# EAGLE schematic Model01_TOT (EAGLE 7.6.0)
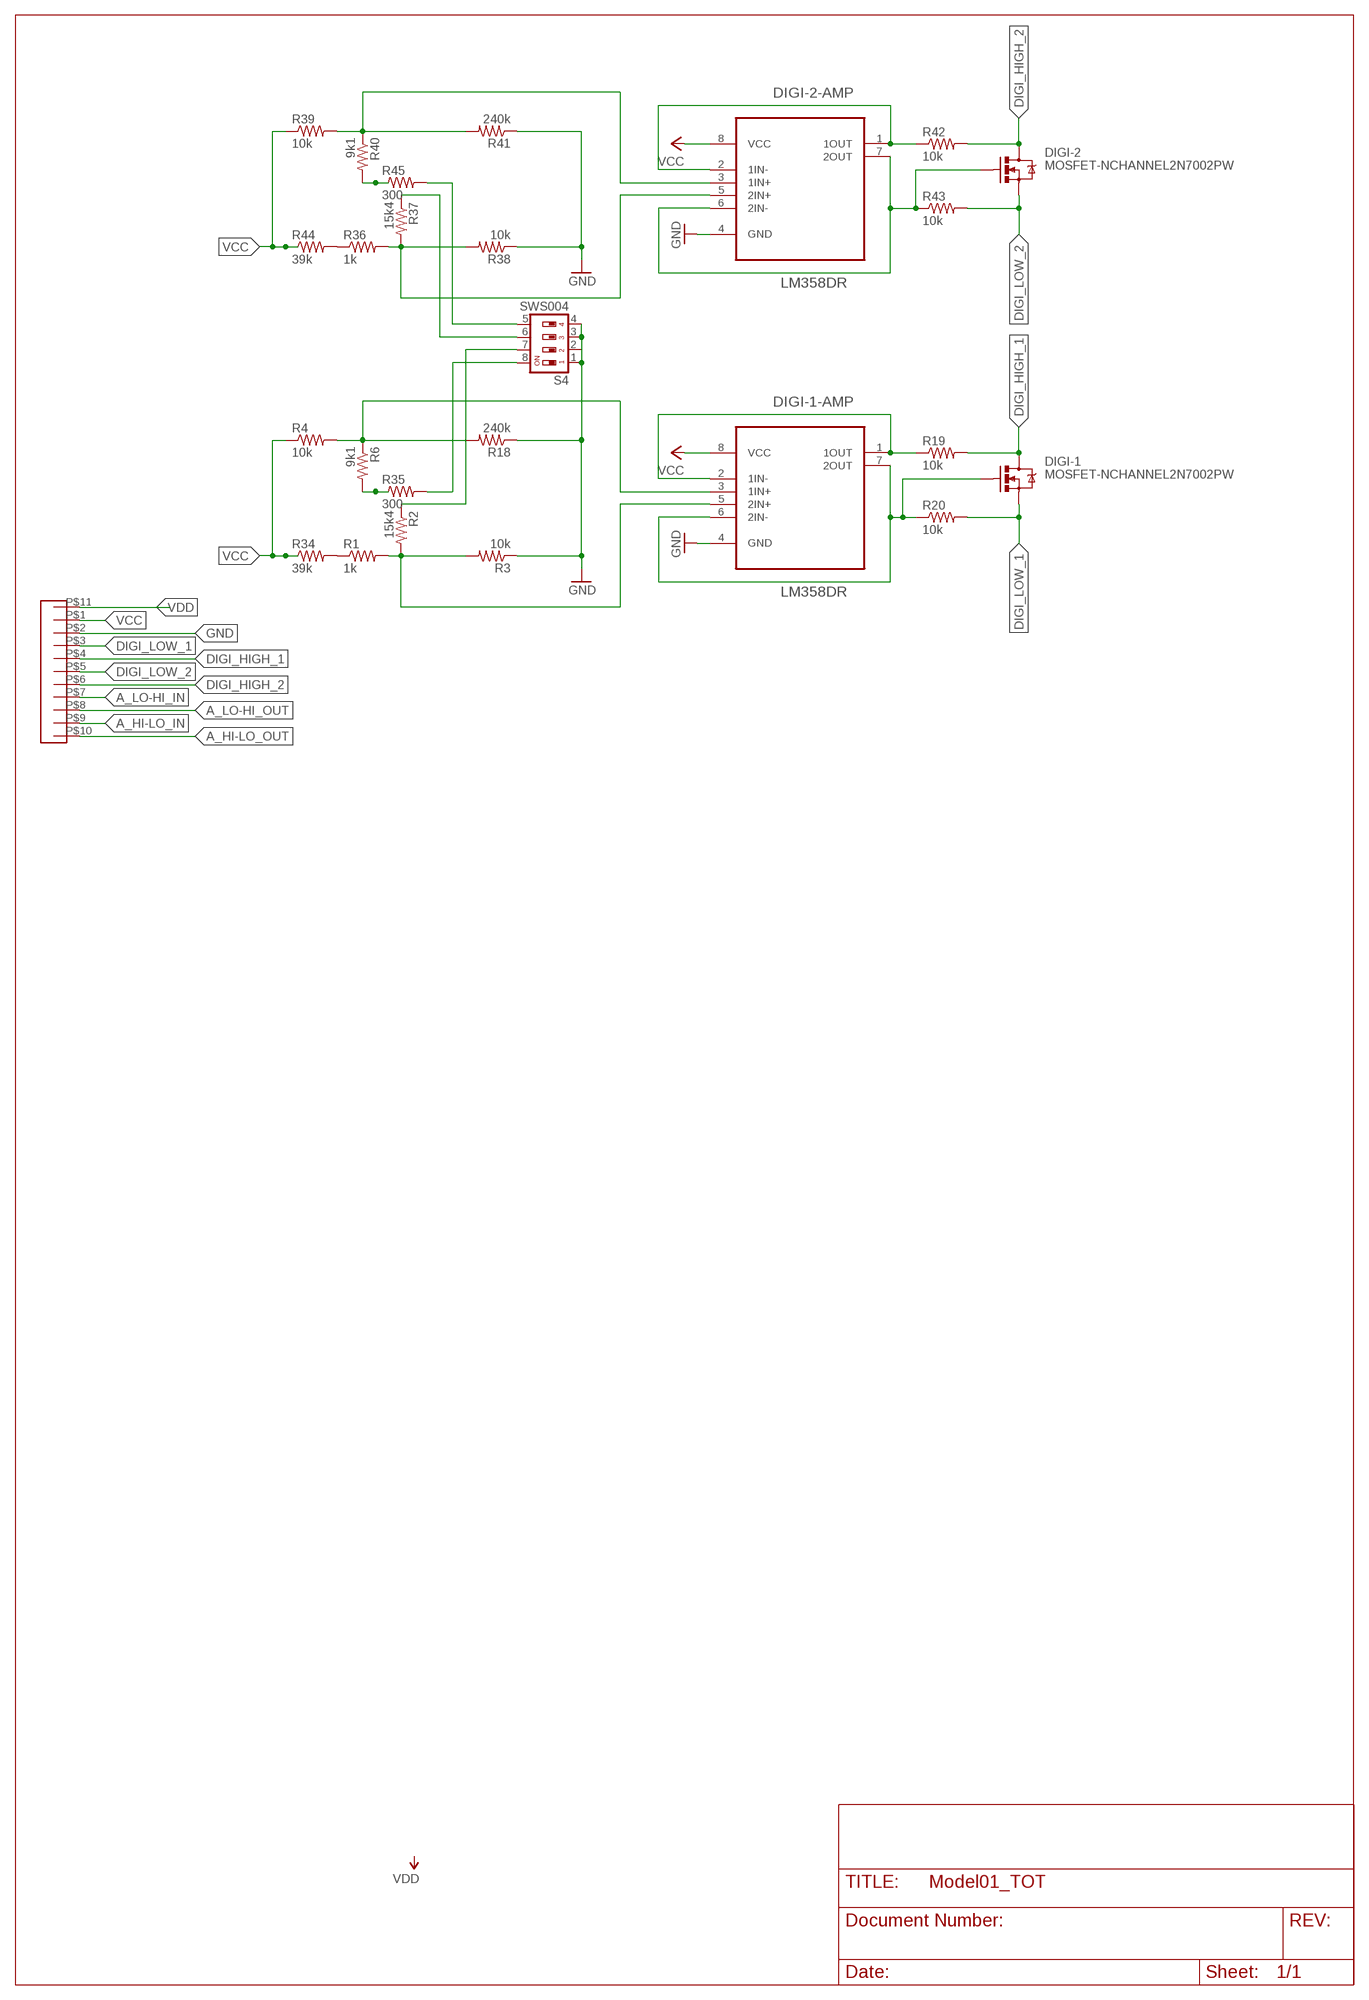
[diagram p0: schematic, sheet 1]

## Parts
DIGI-1  MOSFET-NCHANNEL2N7002PW  [SOT323]
DIGI-1-AMP  LM358DR  [SOIC127P600X175-8N]
DIGI-2  MOSFET-NCHANNEL2N7002PW  [SOT323]
DIGI-2-AMP  LM358DR  [SOIC127P600X175-8N]
R1  1k  R-US_R0805  [R0805]
R2  15k4  R-US_R0805  [R0805]
R3  10k  R-US_R0805  [R0805]
R4  10k  R-US_R0805  [R0805]
R6  9k1  R-US_R0805  [R0805]
R18  240k  R-US_R0805  [R0805]
R19  10k  R-US_R0805  [R0805]
R20  10k  R-US_R0805  [R0805]
R34  39k  R-US_R0805  [R0805]
R35  300  R-US_R0805  [R0805]
R36  1k  R-US_R0805  [R0805]
R37  15k4  R-US_R0805  [R0805]
R38  10k  R-US_R0805  [R0805]
R39  10k  R-US_R0805  [R0805]
R40  9k1  R-US_R0805  [R0805]
R41  240k  R-US_R0805  [R0805]
R42  10k  R-US_R0805  [R0805]
R43  10k  R-US_R0805  [R0805]
R44  39k  R-US_R0805  [R0805]
R45  300  R-US_R0805  [R0805]
S4  SWS004  [SMS-004]
U$1  5.08PITCHTERMINAL  [10KPL508]

## Nets
A_HI-LO_IN: U$1.P$9
A_HI-LO_OUT: U$1.P$10
A_LO-HI_IN: U$1.P$7
A_LO-HI_OUT: U$1.P$8
DI-1: DIGI-1-AMP.1(1OUT) DIGI-1-AMP.2(1IN-) R19.1
DIGI_HIGH_1: DIGI-1.3(D) R19.2 U$1.P$4
DIGI_HIGH_2: DIGI-2.3(D) R42.2 U$1.P$6
DIGI_LOW_1: DIGI-1.2(S) R20.2 U$1.P$3
DIGI_LOW_2: DIGI-2.2(S) R43.2 U$1.P$5
GND: DIGI-1-AMP.4(GND) DIGI-2-AMP.4(GND) R3.1 R18.1 R38.1 R41.1 S4.1 S4.2 S4.3 S4.4 U$1.P$2
N$2: DIGI-1-AMP.3(1IN+) R4.2 R6.1 R18.2
N$4: R2.1 S4.7
N$5: R6.2 R35.1
N$6: DIGI-1-AMP.5(2IN+) R1.2 R2.2 R3.2
N$8: DIGI-1-AMP.6(2IN-) DIGI-1-AMP.7(2OUT) DIGI-1.1(G) R20.1
N$9: DIGI-2-AMP.5(2IN+) R36.2 R37.2 R38.2
N$11: DIGI-2-AMP.3(1IN+) R39.2 R40.1 R41.2
N$15: R1.1 R34.2
N$42: R35.2 S4.8
N$63: DIGI-2-AMP.1(1OUT) DIGI-2-AMP.2(1IN-) R42.1
N$64: DIGI-2-AMP.6(2IN-) DIGI-2-AMP.7(2OUT) DIGI-2.1(G) R43.1
N$67: R37.1 S4.6
N$68: R36.1 R44.2
N$69: R40.2 R45.1
N$70: R45.2 S4.5
VCC: DIGI-1-AMP.8(VCC) DIGI-2-AMP.8(VCC) R4.1 R34.1 R39.1 R44.1 U$1.P$1
VDD: U$1.P$11

## Library data of the parts
DIGI-1 DIGI-2 = SparkFun-DiscreteSemi:MOSFET-NCHANNEL: Common NMOSFET Parts MFG P/N Store ID Prod ID FDD8780 TRANS-09984 SI7820DN TRANS-11055 FDS6630A IC-08089 2N7002PW TRANS-11151 FQP30N06L COM-10213 TRANS-10060 BSS123LT1G TRANS-08345 BSS138 TRANS-00830 BS170 2N7000; PROD_ID: TRANS-11151
DIGI-1-AMP DIGI-2-AMP = Texas Instruments_By_element14_Batch_1:LM358DR: OPERATIONAL AMPLIFIERS; MPN: LM358DR; OC_FARNELL: 1831865; OC_NEWARK: 34K7599; PACKAGE: SOIC-8; SUPPLIER: Texas Instruments
R1-R4 R6 R18-R20 R34-R45 = rcl:R-US_: RESISTOR, American symbol
S4 = smd-special:SWS004: SMD Dip Switch 4 pol.
U$1 = ruuviliitin:5.08PITCHTERMINAL

## Net classes
0 default: clearance 0.205 mm